# EAGLE schematic renovaf24-pcb-1.0 (EAGLE 7.1.0)
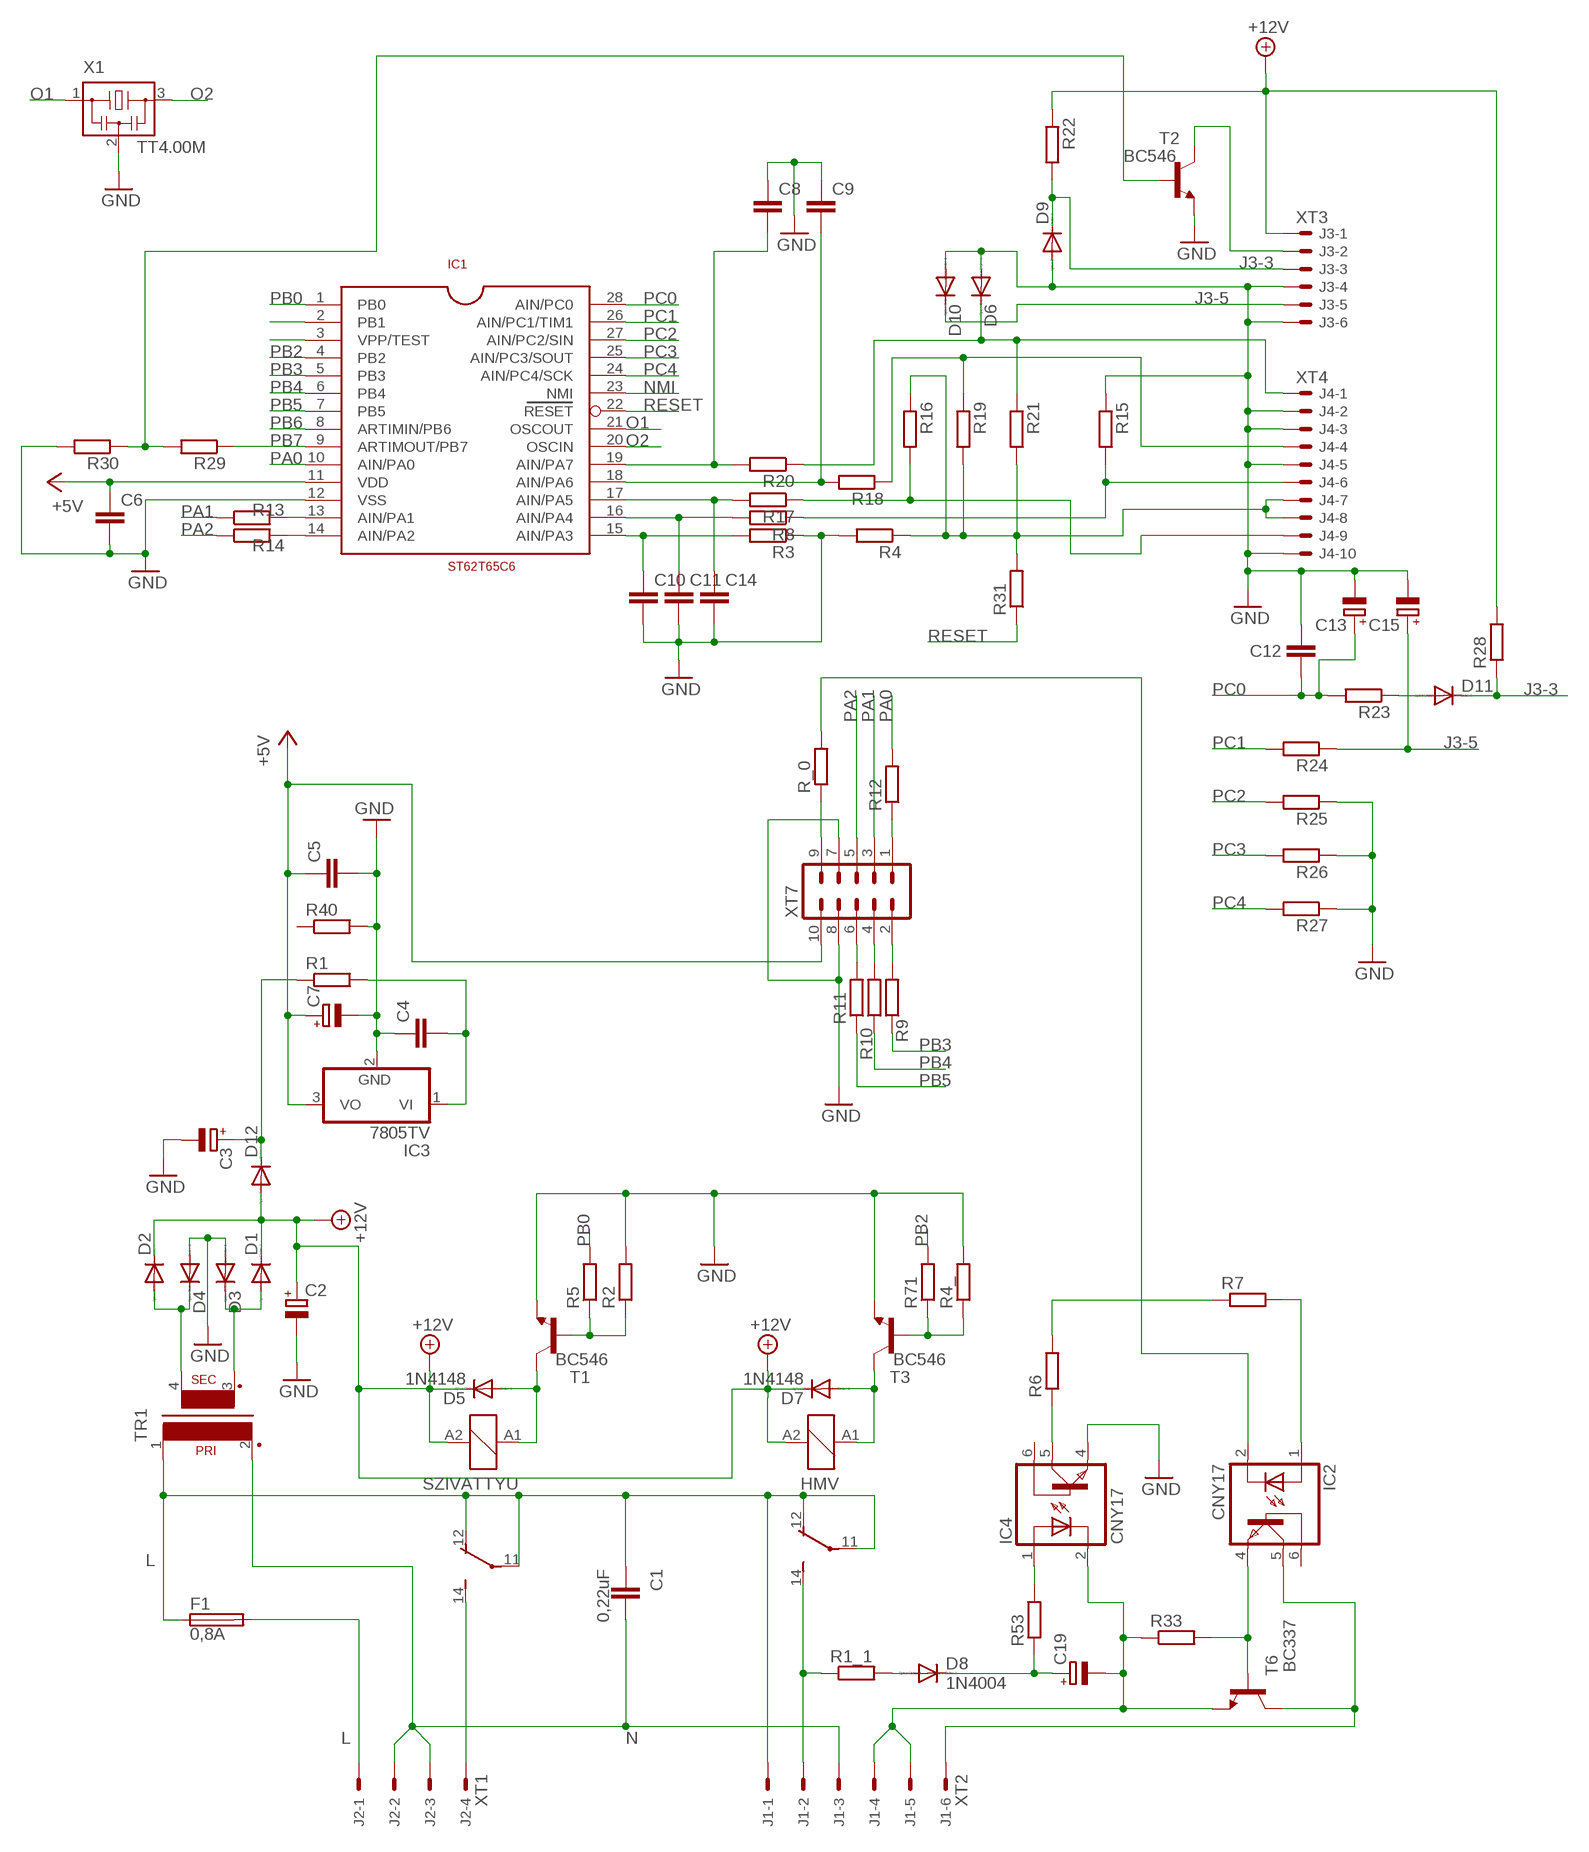
[diagram p0: schematic, sheet 1]

## Parts
C1  0,22uF  C-EU225-062X268  [C225-062X268]
C2  CPOL-EUE3.5-8  [E3,5-8]
C3  CPOL-EUE3.5-8  [E3,5-8]
C4  C-EU025-025X050  [C025-025X050]
C5  C-EU025-025X050  [C025-025X050]
C6  C-EU025-025X050  [C025-025X050]
C7  CPOL-EUE3.5-8  [E3,5-8]
C8  C-EU025-025X050  [C025-025X050]
C9  C-EU025-025X050  [C025-025X050]
C10  C-EU025-025X050  [C025-025X050]
C11  C-EU025-025X050  [C025-025X050]
C12  C-EU025-025X050  [C025-025X050]
C13  CPOL-EUE3.5-8  [E3,5-8]
C14  C-EU025-025X050  [C025-025X050]
C15  CPOL-EUE3.5-8  [E3,5-8]
C19  CPOL-EUE3.5-8  [E3,5-8]
D1  1N4004  [DO41-10]
D2  1N4004  [DO41-10]
D3  1N4004  [DO41-10]
D4  1N4004  [DO41-10]
D5  1N4148  1N4148DO35-7  [DO35-7]
D6  1N4004  [DO41-10]
D7  1N4148  1N4148DO35-7  [DO35-7]
D8  1N4004  [DO41-10]
D9  1N4004  [DO41-10]
D10  1N4004  [DO41-10]
D11  1N4004  [DO41-10]
D12  1N4004  [DO41-10]
F1  0,8A  FUSEBLANK_5X20MM  [FUSE_HOLDER_5X20MM]
HMV  RP510006  [RP51]
IC1  ST62T65C6  [ST62T65C6]
IC2  CNY17  [DIL06]
IC3  7805TV  [TO220V]
IC4  CNY17  [DIL06]
J1  XT2  22-27-2061-06  [6410-06]
J2  XT1  22-27-2041-04  [6410-04]
J3  XT3  22-23-2061  [22-23-2061]
J4  XT4  22-23-2101  [22-23-2101]
R1  R-EU_0207/10  [0207/10]
R1_1  R-EU_0207/10  [0207/10]
R2  R-EU_0207/10  [0207/10]
R3  R-EU_0207/10  [0207/10]
R4  R-EU_0207/10  [0207/10]
R4_  R-EU_0207/10  [0207/10]
R5  R-EU_0207/10  [0207/10]
R6  R-EU_0207/10  [0207/10]
R7  R-EU_0207/10  [0207/10]
R8  R-EU_0207/10  [0207/10]
R9  R-EU_0207/10  [0207/10]
R10  R-EU_0207/10  [0207/10]
R11  R-EU_0207/10  [0207/10]
R12  R-EU_0207/10  [0207/10]
R13  R-EU_0207/10  [0207/10]
R14  R-EU_0207/10  [0207/10]
R15  R-EU_0207/10  [0207/10]
R16  R-EU_0207/10  [0207/10]
R17  R-EU_0207/10  [0207/10]
R18  R-EU_0207/10  [0207/10]
R19  R-EU_0207/10  [0207/10]
R20  R-EU_0207/10  [0207/10]
R21  R-EU_0207/10  [0207/10]
R22  R-EU_0207/10  [0207/10]
R23  R-EU_0207/10  [0207/10]
R24  R-EU_0207/10  [0207/10]
R25  R-EU_0207/10  [0207/10]
R26  R-EU_0207/10  [0207/10]
R27  R-EU_0207/10  [0207/10]
R28  R-EU_0207/10  [0207/10]
R29  R-EU_0207/10  [0207/10]
R30  R-EU_0207/10  [0207/10]
R31  R-EU_0207/10  [0207/10]
R33  R-EU_0207/10  [0207/10]
R40  R-EU_0207/10  [0207/10]
R53  R-EU_0207/10  [0207/10]
R71  R-EU_0207/10  [0207/10]
R_0  R-EU_0207/10  [0207/10]
SZIVATTYU  RP510006  [RP51]
T1  BC546  BC546-NPN-TO92-CBE  [TO92-CBE]
T2  BC546  BC546-NPN-TO92-CBE  [TO92-CBE]
T3  BC546  BC546-NPN-TO92-CBE  [TO92-CBE]
T6  BC337  BC337-NPN-TO92-CBE  [TO92-CBE]
TR1  VP31  [VP31]
X1  TT4.00M  CSTCR6M00G53Z  [CSTCR6M]
XT7  MA05-2  [MA05-2]

## Nets
+5V: C5.1 C6.1 C7.+ IC1.11(VDD) IC3.3(VO) XT7.10
+12V: C2.+ D1.C D2.C D5.C D7.C D12.A HMV.A2 J3.1 R22.1 R28.2 SZIVATTYU.A2
GND: C2.- C3.- C4.1 C5.2 C6.2 C7.- C8.1 C9.1 C10.2 C11.2 C12.1 C13.- C14.2 C15.- D3.A D4.A D6.A D9.A D10.A IC1.12(VSS) IC3.2(GND) IC4.4(EMI) J3.4 J3.6 J4.2 J4.3 J4.5 J4.10 R2.2 R3.1 R4.2 R4_.2 R15.1 R25.1 R26.1 R27.1 R30.2 R40.2 T1.E T2.E T3.E X1.2 XT7.7 XT7.8
J3-3: D9.C D11.C J3.3 R22.2 R28.1
J3-5: C15.+ D10.C J3.5 R24.1
L: C1.2 F1.1 HMV.11(2:P) HMV.12(2:O) J1.1 SZIVATTYU.11(2:P) SZIVATTYU.12(2:O) TR1.1
N: C1.1 J1.3 J2.2 J2.3 TR1.2
N$1: D8.A R1_1.2
N$2: J2.4 SZIVATTYU.14(2:S)
N$3: F1.2 J2.1
N$4: C19.+ D8.C R53.1
N$5: D5.A SZIVATTYU.A1 T1.C
N$6: R2.1 R5.1 T1.B
N$7: HMV.14(2:S) J1.2 R1_1.1
N$8: IC2.2(C) R_0.2
N$9: D7.A HMV.A1 T3.C
N$10: R4_.1 R71.1 T3.B
N$11: IC4.1(A) R53.2
N$12: IC1.2(PB1)
N$13: IC1.3(VPP/TEST)
N$14: IC2.1(A) R7.2
N$15: R12.1 XT7.1
N$16: D6.C J4.1 R20.1 R21.1
N$17: J4.6 R8.1 R15.2
N$18: J4.7 J4.8 R4.1 R16.1 R19.2 R21.2 R31.2
N$19: J4.4 R18.1 R19.1
N$20: J4.9 R16.2 R17.1
N$21: D11.A R23.1
N$22: J3.2 T2.C
N$23: IC1.13(AIN/PA1) R13.2
N$24: IC1.14(AIN/PA2) R14.2
N$25: C10.1 IC1.15(AIN/PA3) R3.2
N$26: C11.1 IC1.16(AIN/PA4) R8.2
N$27: C14.1 IC1.17(AIN/PA5) R17.2
N$28: C9.2 IC1.18(AIN/PA6) R18.2
N$29: C8.2 IC1.19(AIN/PA7) R20.2
N$31: R29.2 T2.B
N$39: C19.- IC4.2(C) J1.4 J1.5 R33.1 T6.E
N$40: IC2.4(EMI) R33.2 T6.B
N$41: IC4.5(COL) R6.1
N$42: IC2.5(COL) J1.6 T6.C
N$43: R6.2 R7.1
N$44: D2.A D4.C TR1.4(S4)
N$45: D1.A D3.C TR1.3(S3)
N$46: C3.+ D12.C R1.1
N$47: R_0.1 XT7.9
N$49: C4.2 IC3.1(VI) R1.2
N$52: R11.2 XT7.6
N$53: R10.2 XT7.4
N$54: R9.2 XT7.2
NMI: IC1.23(NMI)
O1: IC1.21(OSCOUT) X1.1
O2: IC1.20(OSCIN) X1.3
PA0: IC1.10(AIN/PA0) R12.2
PA1: R13.1 XT7.3
PA2: R14.1 XT7.5
PB0: IC1.1(PB0) R5.2
PB2: IC1.4(PB2) R71.2
PB3: IC1.5(PB3) R9.1
PB4: IC1.6(PB4) R10.1
PB5: IC1.7(PB5) R11.1
PB6: IC1.8(ARTIMIN/PB6)
PB7: IC1.9(ARTIMOUT/PB7) R29.1
PC0: C12.2 C13.+ IC1.28(AIN/PC0) R23.2
PC1: IC1.26(AIN/PC1/TIM1) R24.2
PC2: IC1.27(AIN/PC2/SIN) R25.2
PC3: IC1.25(AIN/PC3/SOUT) R26.2
PC4: IC1.24(AIN/PC4/SCK) R27.2
RESET: IC1.22(RESET) R31.1
Unconnected: IC2.6(BAS) IC4.6(BAS) R30.1 R40.1

## Library data of the parts
C1 C4-C6 C8-C12 C14 = rcl:C-EU: CAPACITOR, European symbol
C2 C3 C7 C13 C15 C19 = rcl:CPOL-EU: POLARIZED CAPACITOR, European symbol
D1-D4 D6 D8-D12 = diode:1N4004: DIODE general purpose rectifier, 1 A
D5 D7 = diode:1N4148: DIODE high speed (Philips)
F1 = fuse:FUSE: Fuse; OC_FARNELL: unknown; OC_NEWARK: unknown
HMV SZIVATTYU = relay:RP51*: Power PCB Relay RP I SCHRACK 1 pole 8 A Vertical version Source: http://www.schrack.com/.. 5845.pdf; OC_FARNELL: unknown; OC_NEWARK: unknown
IC1 = ST62T65C6:ST62T65C6
IC2 IC4 = optocoupler:CNY17: SIEMENS OPTO COUPLER; MPN: CNY17-1; OC_FARNELL: 1045399; OC_NEWARK: 05M4044
IC3 = linear:78*: Positive VOLTAGE REGULATOR Source: http://cache.national.com/ds/LM/LM78L05.pdf http://www.fairchildsemi.com/ds/LM/LM7805.pdf
J1 = con-molex:22-?-06: CONNECTOR wire to board 2.54 mm (.1 inch) pitch header; OC_FARNELL: unknown; OC_NEWARK: unknown
J2 = con-molex:22-?-04: CONNECTOR wire to board 2.54 mm (.1 inch) pitch header; OC_FARNELL: unknown; OC_NEWARK: unknown
J3 = con-molex:22-23-2061: .100" (2.54mm) Center Header - 6 Pin; MF: MOLEX; MPN: 22-23-2061; OC_FARNELL: 1462922; OC_NEWARK: 27C1933
J4 = con-molex:22-23-2101: .100" (2.54mm) Center Header - 10 Pin; MF: MOLEX; MPN: 22-23-2101; OC_FARNELL: 1756828; OC_NEWARK: 94C0765
R1 R1_1 R2-R4 R4_ R5-R31 R33 R40 R53 R71 R_0 = rcl:R-EU_: RESISTOR, European symbol
T1-T3 T6 = transistor:*-NPN-: NPN Transistror BF959 corrected 2008.03.06
TR1 = trafo:VP31: TRANSFORMER 1 primary winding, 1 secondary winding BLOCK
X1 = murata-filter:CSTCR: Resonator Source: murata.co.jp; MPN: CSTCR6M00G53-R0; OC_FARNELL: 1170434; OC_NEWARK: 25M8759
XT7 = con-lstb:MA05-2: PIN HEADER; OC_FARNELL: unknown; OC_NEWARK: unknown